# Altium schematic sheet IMX8_PMIC.SchDoc
size 594 x 420 mm; SheetNumber: 11; SheetTotal: 12
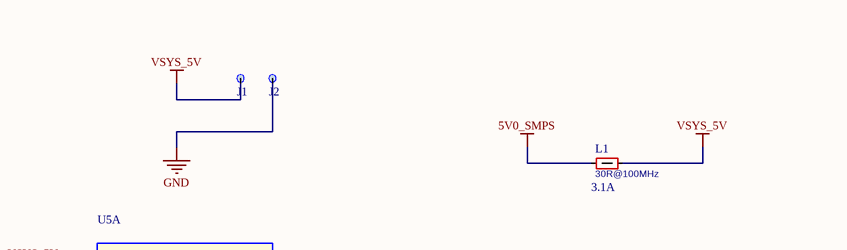
[diagram p0: IMX8_PMIC.SchDoc, top left]
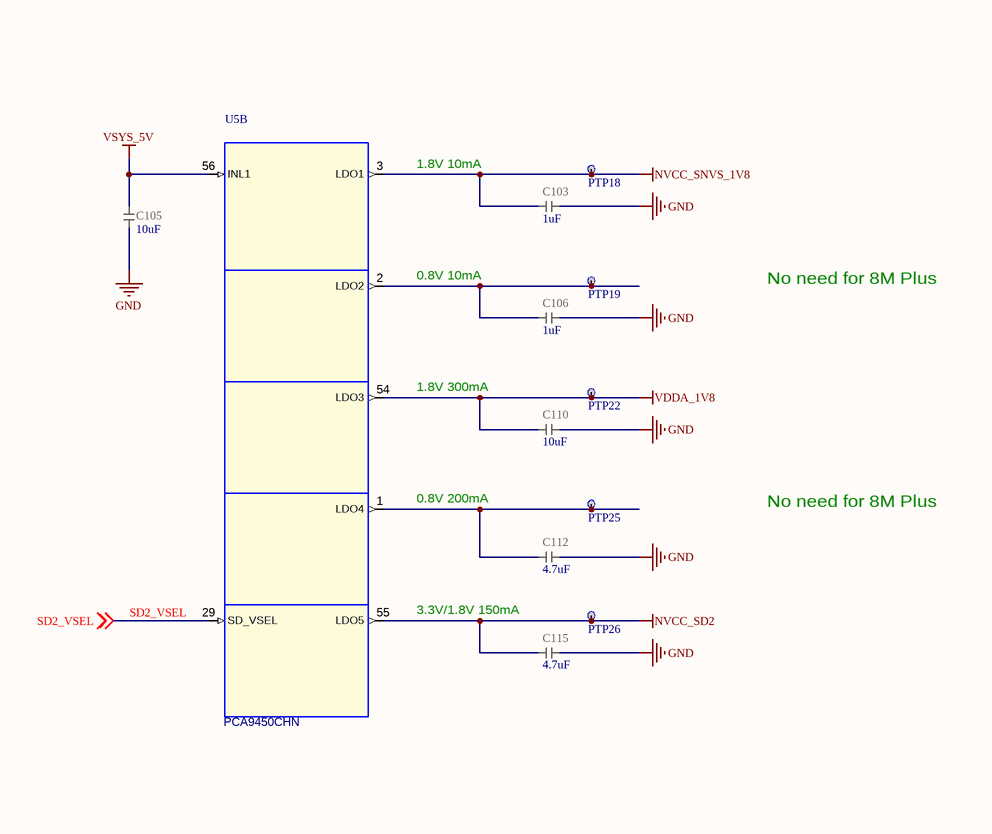
[diagram p1: IMX8_PMIC.SchDoc, top right]
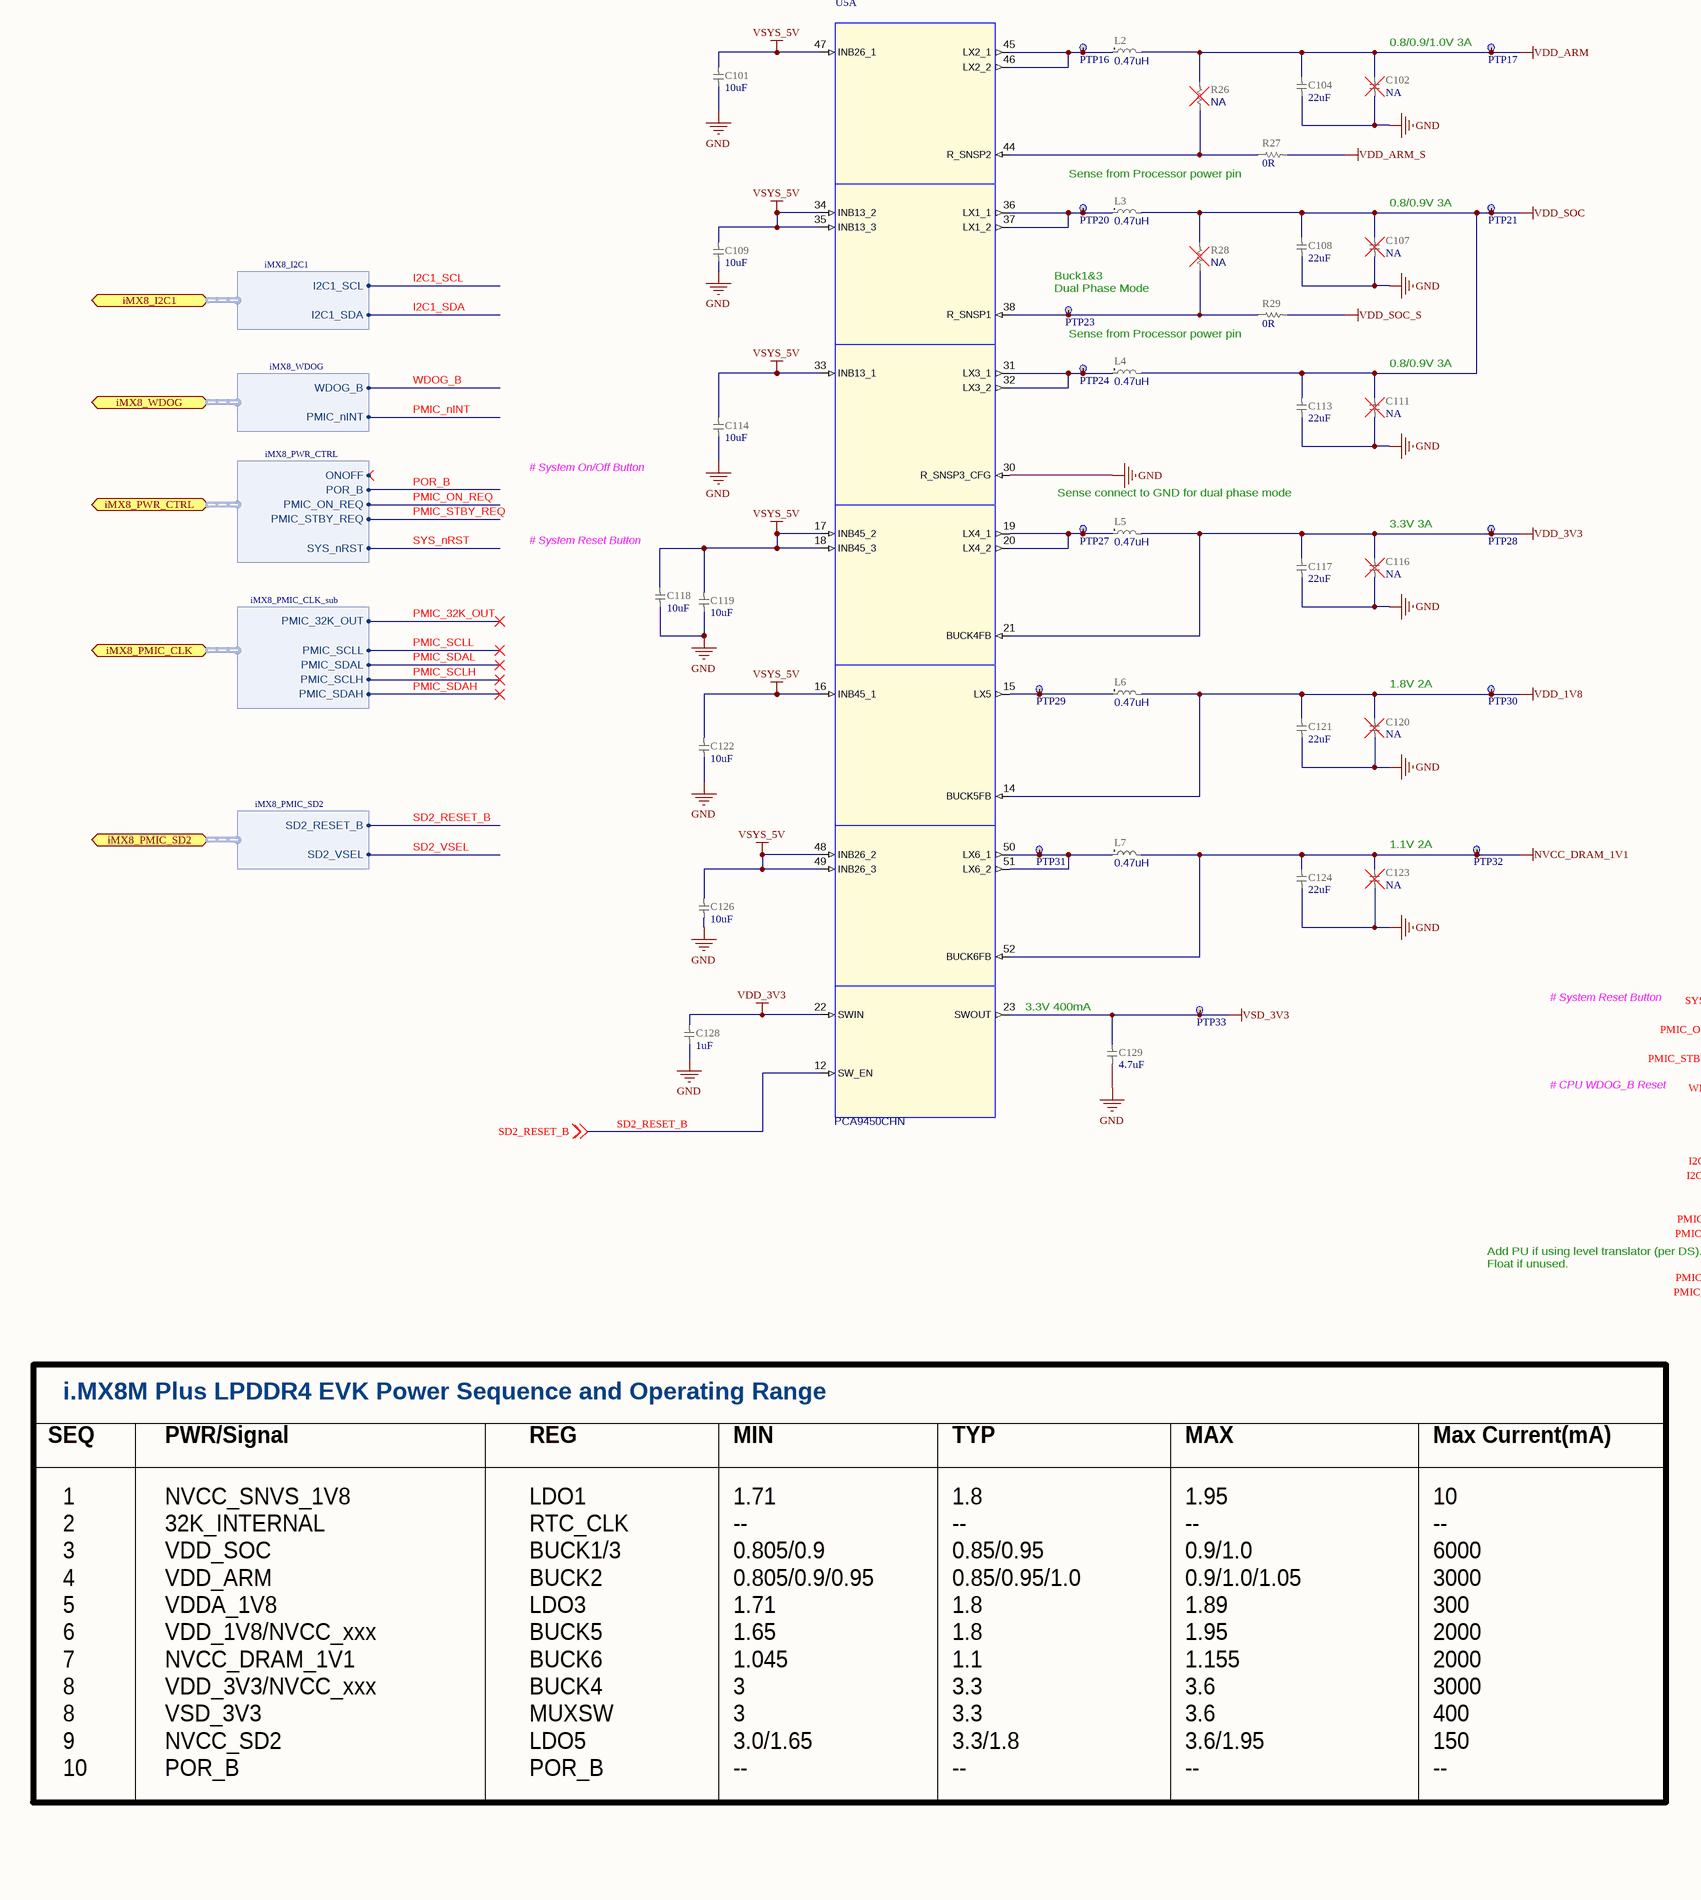
[diagram p2: IMX8_PMIC.SchDoc, bottom left]
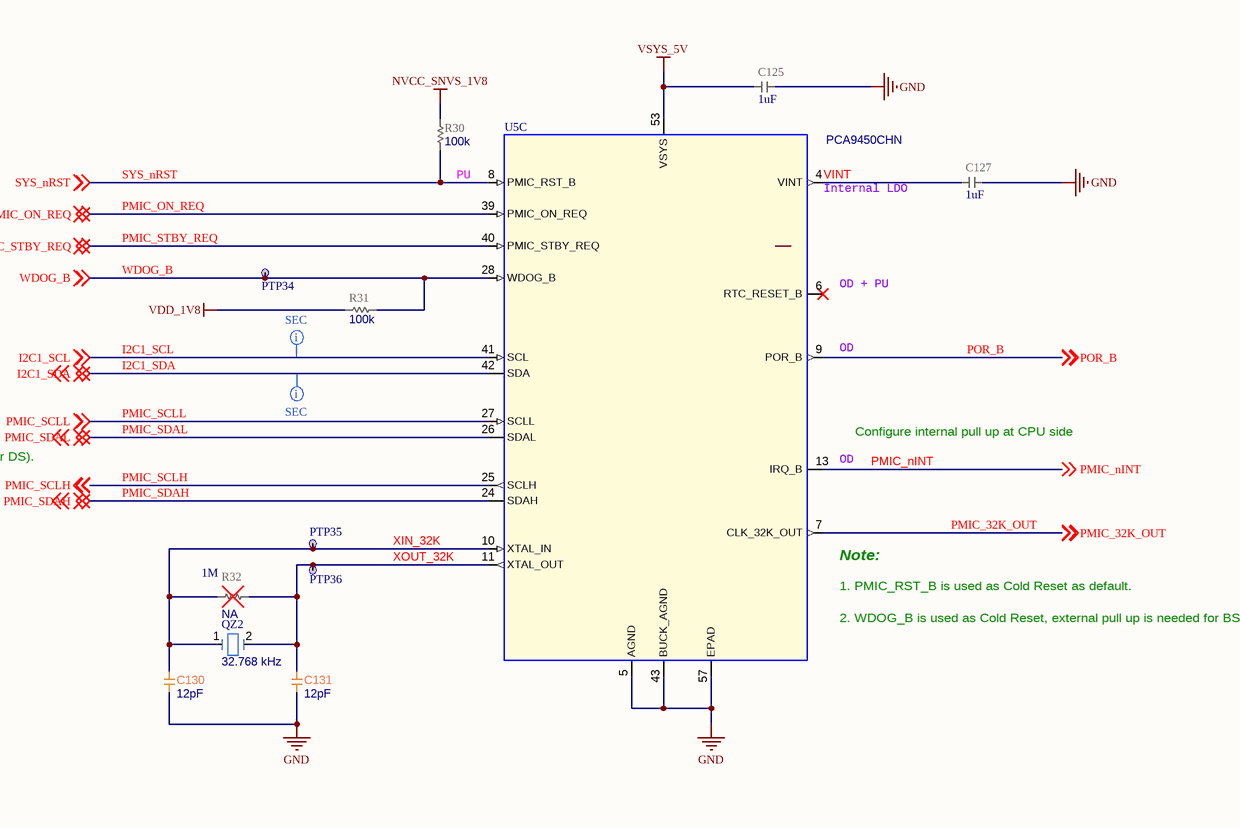
[diagram p3: IMX8_PMIC.SchDoc, bottom right]

## Parts
C101  value 10uF  [CAP_0603_UN1Q]  (hidden comment: CAP_0603_10u_10V_X7R)
C102  value NA  [CAP_0603_UN1Q]  (hidden comment: CAP_0603_NA)
C103  value 1uF  [CAP_0201_UN1Q]  (hidden comment: CAP_0201_1uF_X6S)
C104  value 22uF  [CAP_0603_UN1Q]  (hidden comment: CAP_0603_22u_6.3V_X6S)
C105  value 10uF  [CAP_0603_UN1Q]  (hidden comment: CAP_0603_10u_10V_X7R)
C106  value 1uF  [CAP_0201_UN1Q]  (hidden comment: CAP_0201_1uF_X6S)
C107  value NA  [CAP_0603_UN1Q]  (hidden comment: CAP_0603_NA)
C108  value 22uF  [CAP_0603_UN1Q]  (hidden comment: CAP_0603_22u_6.3V_X6S)
C109  value 10uF  [CAP_0603_UN1Q]  (hidden comment: CAP_0603_10u_10V_X7R)
C110  value 10uF  [CAP_0402_H09W07_UN1Q]  (hidden comment: CAP_0402_10u_X6S)
C111  value NA  [CAP_0603_UN1Q]  (hidden comment: CAP_0603_NA)
C112  value 4.7uF  [CAP_0402_H09W07_UN1Q]  (hidden comment: CAP_0402_4u7_10V_X6S)
C113  value 22uF  [CAP_0603_UN1Q]  (hidden comment: CAP_0603_22u_6.3V_X6S)
C114  value 10uF  [CAP_0603_UN1Q]  (hidden comment: CAP_0603_10u_10V_X7R)
C115  value 4.7uF  [CAP_0402_H09W07_UN1Q]  (hidden comment: CAP_0402_4u7_10V_X6S)
C116  value NA  [CAP_0603_UN1Q]  (hidden comment: CAP_0603_NA)
C117  value 22uF  [CAP_0603_UN1Q]  (hidden comment: CAP_0603_22u_6.3V_X6S)
C118  value 10uF  [CAP_0603_UN1Q]  (hidden comment: CAP_0603_10u_10V_X7R)
C119  value 10uF  [CAP_0603_UN1Q]  (hidden comment: CAP_0603_10u_10V_X7R)
C120  value NA  [CAP_0603_UN1Q]  (hidden comment: CAP_0603_NA)
C121  value 22uF  [CAP_0603_UN1Q]  (hidden comment: CAP_0603_22u_6.3V_X6S)
C122  value 10uF  [CAP_0603_UN1Q]  (hidden comment: CAP_0603_10u_10V_X7R)
C123  value NA  [CAP_0603_UN1Q]  (hidden comment: CAP_0603_NA)
C124  value 22uF  [CAP_0603_UN1Q]  (hidden comment: CAP_0603_22u_6.3V_X6S)
C125  value 1uF  [CAP_0402_UN1Q]  (hidden comment: CAP_0402_1uF_10V_X7R)
C126  value 10uF  [CAP_0603_UN1Q]  (hidden comment: CAP_0603_10u_10V_X7R)
C127  value 1uF  [CAP_0402_UN1Q]  (hidden comment: CAP_0402_1uF_10V_X7R)
C128  value 1uF  [CAP_0402_UN1Q]  (hidden comment: CAP_0402_1uF_10V_X7R)
C129  value 4.7uF  [CAP_0402_H09W07_UN1Q]  (hidden comment: CAP_0402_4u7_10V_X6S)
C130  value 12pF  [CAP_0201_UN1Q]  (hidden comment: CAP_0201_12pF_RF_MATCHING)
C131  value 12pF  [CAP_0201_UN1Q]  (hidden comment: CAP_0201_12pF_RF_MATCHING)
J1  PAD 1 x 2 mm  [TP_1x2mm_UN1Q]  (value not drawn)  (no BOM)
J2  PAD 1 x 2 mm  [TP_1x2mm_UN1Q]  (value not drawn)  (no BOM)
L1  value 30R@100MHz  Current: 3.1A  [FERR_BLM15KD]  (hidden comment: FERRITE_0402_BLM15KD)
L2  value 0.47uH  [IND_VLS2520]  (hidden comment: IND_VLS2520_0u47)
L3  value 0.47uH  [IND_VLS2520]  (hidden comment: IND_VLS2520_0u47)
L4  value 0.47uH  [IND_VLS2520]  (hidden comment: IND_VLS2520_0u47)
L5  value 0.47uH  [IND_VLS2520]  (hidden comment: IND_VLS2520_0u47)
L6  value 0.47uH  [IND_VLS2520]  (hidden comment: IND_VLS2520_0u47)
L7  value 0.47uH  [IND_VLS2520]  (hidden comment: IND_VLS2520_0u47)
PTP16  PTP_0.4mm  [PTP_0.4mm]  (value not drawn)  (no BOM)
PTP17  PTP_0.4mm  [PTP_0.4mm]  (value not drawn)  (no BOM)
PTP18  PTP_0.4mm  [PTP_0.4mm]  (value not drawn)  (no BOM)
PTP19  PTP_0.4mm  [PTP_0.4mm]  (value not drawn)  (no BOM)
PTP20  PTP_0.4mm  [PTP_0.4mm]  (value not drawn)  (no BOM)
PTP21  PTP_0.4mm  [PTP_0.4mm]  (value not drawn)  (no BOM)
PTP22  PTP_0.4mm  [PTP_0.4mm]  (value not drawn)  (no BOM)
PTP23  PTP_0.4mm  [PTP_0.4mm]  (value not drawn)  (no BOM)
PTP24  PTP_0.4mm  [PTP_0.4mm]  (value not drawn)  (no BOM)
PTP25  PTP_0.4mm  [PTP_0.4mm]  (value not drawn)  (no BOM)
PTP26  PTP_0.4mm  [PTP_0.4mm]  (value not drawn)  (no BOM)
PTP27  PTP_0.4mm  [PTP_0.4mm]  (value not drawn)  (no BOM)
PTP28  PTP_0.4mm  [PTP_0.4mm]  (value not drawn)  (no BOM)
PTP29  PTP_0.4mm  [PTP_0.4mm]  (value not drawn)  (no BOM)
PTP30  PTP_0.4mm  [PTP_0.4mm]  (value not drawn)  (no BOM)
PTP31  PTP_0.4mm  [PTP_0.4mm]  (value not drawn)  (no BOM)
PTP32  PTP_0.4mm  [PTP_0.4mm]  (value not drawn)  (no BOM)
PTP33  PTP_0.4mm  [PTP_0.4mm]  (value not drawn)  (no BOM)
PTP34  PTP_0.4mm  [PTP_0.4mm]  (value not drawn)  (no BOM)
PTP35  PTP_0.4mm  [PTP_0.4mm]  (value not drawn)  (no BOM)
PTP36  PTP_0.4mm  [PTP_0.4mm]  (value not drawn)  (no BOM)
QZ2  value 32.768 kHz  [CM8V32768TA020125_MC]  (hidden comment: XTAL_CM8V-T1A-32_768KHZ-9PF-20PPM-TA-QC)
R26  value NA  [RES_0201_UN1Q]  (hidden comment: RES_0201_NA)
R27  value 0R  [RES_0201_UN1Q]  (hidden comment: RES_0201_0R)
R28  value NA  [RES_0201_UN1Q]  (hidden comment: RES_0201_NA)
R29  value 0R  [RES_0201_UN1Q]  (hidden comment: RES_0201_0R)
R30  value 100k  [RES_0201_UN1Q]  (hidden comment: RES_0201_100k)
R31  value 100k  [RES_0201_UN1Q]  (hidden comment: RES_0201_100k)
R32  value NA  [RES_0201_UN1Q]  (hidden comment: RES_0201_NA)
U5  Part Number: PCA9450CHN  [QFN57P40_700X700X100NXP]  (hidden comment: PCA9450_HVQFN56P_A)  (parts A,B,C of 3)

## Ports
iMX8_I2C1 (bidir, harness iMX8_I2C1), iMX8_PMIC_CLK (bidir, harness iMX8_PMIC_CLK_sub), iMX8_PMIC_SD2 (bidir, harness iMX8_PMIC_SD2), iMX8_PWR_CTRL (bidir, harness iMX8_PWR_CTRL), iMX8_WDOG (bidir, harness iMX8_WDOG)

## Harnesses
iMX8_PMIC_CLK_sub: PMIC_32K_OUT, PMIC_SCLL, PMIC_SDAL, PMIC_SCLH, PMIC_SDAH
iMX8_WDOG: WDOG_B, PMIC_nINT
iMX8_I2C1: I2C1_SCL, I2C1_SDA
iMX8_PWR_CTRL: ONOFF, POR_B, PMIC_ON_REQ, PMIC_STBY_REQ, SYS_nRST
iMX8_PMIC_SD2: SD2_RESET_B, SD2_VSEL

## Nets
5V0_SMPS: L1.1
GND: C101.1 C102.2 C103.2 C104.1 C105.1 C106.2 C107.2 C108.1 C109.1 C110.2 C111.2 C112.1 C113.1 C114.1 C115.1 C116.2 C117.1 C118.1 C119.1 C120.1 C121.2 C122.1 C123.2 C124.1 C125.1 C126.1 C127.1 C128.1 C129.2 C130.2 C131.2 J2.1(TP) U5.5(AGND) U5.30(R_SNSP3_CFG) U5.43(BUCK_AGND) U5.57(EPAD)
NVCC_DRAM_1V1: C123.1 C124.2 L7.2 PTP32.1(TP) U5.52(BUCK6FB)
NVCC_SD2: C115.2 PTP26.1(TP) U5.55(LDO5)
NVCC_SNVS_1V8: C103.1 PTP18.1(TP) R30.1 U5.3(LDO1)
VDD_1V8: C120.2 C121.1 L6.2 PTP30.1(TP) R31.1 U5.14(BUCK5FB)
VDD_3V3: C116.1 C117.2 C128.2 L5.2 PTP28.1(TP) U5.21(BUCK4FB) U5.22(SWIN)
VDD_ARM: C102.1 C104.2 L2.2 PTP17.1(TP) R26.2
VDD_ARM_S: R27.2
VDD_SOC: C107.1 C108.2 C111.1 C113.2 L3.2 L4.2 PTP21.1(TP) R28.2
VDD_SOC_S: R29.2
VDDA_1V8: C110.1 PTP22.1(TP) U5.54(LDO3)
VSD_3V3: C129.1 PTP33.1(TP) U5.23(SWOUT)
VSYS_5V: C101.2 C105.2 C109.2 C114.2 C118.2 C119.2 C122.2 C125.2 C126.2 J1.1(TP) L1.2 U5.16(INB45_1) U5.17(INB45_2) U5.18(INB45_3) U5.33(INB13_1) U5.34(INB13_2) U5.35(INB13_3) U5.47(INB26_1) U5.48(INB26_2) U5.49(INB26_3) U5.53(VSYS) U5.56(INL1)
I2C1_SCL: U5.41(SCL) ; off-sheet I2C1_SCL, port iMX8_I2C1.I2C1_SCL
I2C1_SDA: U5.42(SDA) ; off-sheet I2C1_SDA, port iMX8_I2C1.I2C1_SDA
PMIC_32K_OUT: U5.7(CLK_32K_OUT) ; off-sheet PMIC_32K_OUT, port iMX8_PMIC_CLK.PMIC_32K_OUT
PMIC_nINT: U5.13(IRQ_B) ; off-sheet PMIC_nINT, port iMX8_WDOG.PMIC_nINT
PMIC_ON_REQ: U5.39(PMIC_ON_REQ) ; off-sheet PMIC_ON_REQ, port iMX8_PWR_CTRL.PMIC_ON_REQ
PMIC_SCLH: U5.25(SCLH) ; off-sheet PMIC_SCLH, port iMX8_PMIC_CLK.PMIC_SCLH
PMIC_SCLL: U5.27(SCLL) ; off-sheet PMIC_SCLL, port iMX8_PMIC_CLK.PMIC_SCLL
PMIC_SDAH: U5.24(SDAH) ; off-sheet PMIC_SDAH, port iMX8_PMIC_CLK.PMIC_SDAH
PMIC_SDAL: U5.26(SDAL) ; off-sheet PMIC_SDAL, port iMX8_PMIC_CLK.PMIC_SDAL
PMIC_STBY_REQ: U5.40(PMIC_STBY_REQ) ; off-sheet PMIC_STBY_REQ, port iMX8_PWR_CTRL.PMIC_STBY_REQ
POR_B: U5.9(POR_B) ; off-sheet POR_B, port iMX8_PWR_CTRL.POR_B
SD2_RESET_B: U5.12(SW_EN) ; off-sheet SD2_RESET_B, port iMX8_PMIC_SD2.SD2_RESET_B
SD2_VSEL: U5.29(SD_VSEL) ; off-sheet SD2_VSEL, port iMX8_PMIC_SD2.SD2_VSEL
SYS_nRST: R30.2 U5.8(PMIC_RST_B) ; off-sheet SYS_nRST, port iMX8_PWR_CTRL.SYS_nRST
VINT: C127.2 U5.4(VINT)
WDOG_B: PTP34.1(TP) R31.2 U5.28(WDOG_B) ; off-sheet WDOG_B, port iMX8_WDOG.WDOG_B
XIN_32K: C130.1 PTP35.1(TP) QZ2.1 R32.1 U5.10(XTAL_IN)
XOUT_32K: C131.1 PTP36.1(TP) QZ2.2 R32.2 U5.11(XTAL_OUT)
NetC106_1: C106.1 PTP19.1(TP) U5.2(LDO2)
NetC112_2: C112.2 PTP25.1(TP) U5.1(LDO4)
NetL2_1: L2.1 PTP16.1(TP) U5.45(LX2_1) U5.46(LX2_2)
NetL3_1: L3.1 PTP20.1(TP) U5.36(LX1_1) U5.37(LX1_2)
NetL4_1: L4.1 PTP24.1(TP) U5.31(LX3_1) U5.32(LX3_2)
NetL5_1: L5.1 PTP27.1(TP) U5.19(LX4_1) U5.20(LX4_2)
NetL6_1: L6.1 PTP29.1(TP) U5.15(LX5)
NetL7_1: L7.1 PTP31.1(TP) U5.50(LX6_1) U5.51(LX6_2)
NetPTP23_1: PTP23.1(TP) R28.1 R29.1 U5.38(R_SNSP1)
NetR26_1: R26.1 R27.1 U5.44(R_SNSP2)

Not connected (* = marked no-connect by the designer): U5 6(RTC_RESET_B)*

## Layout directives
net class SEC: I2C1_SCL, I2C1_SDA

## Notes on the sheet
- (near PTP17) 0.8/0.9/1.0V 3A
- (near U5) 1.8V 10mA
- Sense from Processor power pin
- (near U5) 0.8V 10mA
- No need for 8M Plus
- 0.8/0.9V 3A
- (near PTP23) Buck1&3
  Dual Phase Mode
- 1.8V 300mA
- (near C111) 0.8/0.9V 3A
- (near U5) 0.8V 200mA
- # System On/Off Button
- Sense connect to GND for dual phase mode
- 3.3V/1.8V 150mA
- (near C118) # System Reset Button
- (near C116) 3.3V 3A
- (near C120) 1.8V 2A
- (near C123) 1.1V 2A
- 3.3V 400mA
- # System Reset Button
- PU
- (near U5) Internal LDO
- # CPU WDOG_B Reset
- (near U5) OD + PU
- (near U5) OD
- (near U5) Configure internal pull up at CPU side
- Add PU if using level translator (per DS).
  Float if unused.
- (near R32) 1M
- (near U5) Note:
- i.MX8M Plus LPDDR4 EVK Power Sequence and Operating Range
- (near U5) 1. PMIC_RST_B is used as Cold Reset as default.
- (near U5) 2. WDOG_B is used as Cold Reset, external pull up is needed for BSDL mode.
- SEQ
- PWR/Signal
- REG
- MIN
- TYP
- MAX
- Max Current(mA)
- NVCC_SNVS_1V8
  32K_INTERNAL
  VDD_SOC
  VDD_ARM
  VDDA_1V8
  VDD_1V8/NVCC_xxx
  NVCC_DRAM_1V1
  VDD_3V3/NVCC_xxx
  VSD_3V3
  NVCC_SD2
  POR_B
- LDO1
  RTC_CLK
  BUCK1/3
  BUCK2
  LDO3
  BUCK5
  BUCK6
  BUCK4
  MUXSW
  LDO5
  POR_B
- 1.71
  --
  0.805/0.9
  0.805/0.9/0.95
  1.71
  1.65
  1.045
  3
  3
  3.0/1.65
  --
- 1.8
  --
  0.85/0.95
  0.85/0.95/1.0
  1.8
  1.8
  1.1
  3.3
  3.3
  3.3/1.8
  --
- 1.95
  --
  0.9/1.0
  0.9/1.0/1.05
  1.89
  1.95
  1.155
  3.6
  3.6
  3.6/1.95
  --
- 10
  --
  6000
  3000
  300
  2000
  2000
  3000
  400
  150
  --
- 1
  2
  3
  4
  5
  6
  7
  8
  8
  9
  10
- DWG NO:
- REV:
- THIS DOCUMENT AND THE DATA DISCLOSED HEREIN OR
- HEREWITH IS THE PROPERTY OF ALTIUM LIMITED AND MAY
- BE FREELY DISTRIBUTED IN WHOLE. NO RIGHTS ARE
- RESERVED OR EXPRESS OR IMPLIED WARANTEE GIVEN.
- REVISION
- DESCRIPTION
- DATE
- APPROVED
- ENG:
- APPROVALS
- PROJECT
- DSN:
- CHK:
- REFERENCE DOCUMENTS
- PROJECT REVISION:
- TITLE
- DOCUMENT REVISION:
- DESIGN ITEM:
- BOM:
- FAB DWG:
- PCB DWG:
- ASSY DWG:
- SCALE:
- A2
- SIZE
- CAGE CODE
- FILE NAME
- DWG NO.
- SHEET
- OF
- REV

## Library data of the parts
C101 C105 C109 C114 C118 C119 C122 C126 = CMP-001-001253-9: CAP; Part Number: GRM188Z71A106KA73D; Manufacturer: Murata; Voltage: 10V; Tolerance: +/-10%; Temperature characteristics: X7R; Sort order: 306; Alternative component: Allowed; System: RLC; Package: 0603; ComponentLink1Description: 1_Datasheet; ComponentLink2Description: 2_Product page; ComponentLink3Description: 3_X-information; ComponentLink4Description: 4_X-information; Creation date: 20240404; Manufacturer Part Number: GRM188Z71A106KA73D; Component Type: Capacitor
C102 C107 C111 C116 C120 C123 = CMP-001-000259-10: Not Assembled - CAP; Sort order: 999; System: RLC; HasBeenBuilt: TBD; Creation date: 20190101; Package: 0603; Source: RLC_UN1Q.SchLib; ComponentLink3Description: 3_X-information; ComponentLink1Description: 1_Datasheet; ComponentLink2Description: 2_Product page; ComponentLink4Description: 4_X-information; Component Type: Capacitor
C103 C106 = CMP-001-000336-15: CAP; Part Number: KGM03CS61A105MH; Manufacturer: KYOCERA AVX; Temperature characteristics: X6S; Voltage: 10V; Tolerance: +/-20%; Sort order: 302; HasBeenBuilt: False; Alternative component: Allowed; System: RLC; Package: 0201; Operating temperature range: -55C to +105C; ClassName: SMALL; ComponentLink1Description: 1_Datasheet; ComponentLink2Description: 2_Product page; ComponentLink3Description: 3_X-information; ComponentLink4Description: 4_X-information; Creation date: 20190101; Source: RLC_UN1Q.SchLib; Manufacturer Part Number: KGM03CS61A105MH; Component Type: Capacitor
C104 C108 C113 C117 C121 C124 = CMP-001-000890-13: CAP; Part Number: GRM188C80J226ME15D; Manufacturer: Murata; Voltage: 6.3V; Tolerance: +/-20%; Temperature characteristics: X6S; Sort order: 306; HasBeenBuilt: TBD; Alternative component: Allowed; System: RLC; Package: 0603; ComponentLink1Description: 1_Datasheet; ComponentLink2Description: 2_Product page; ComponentLink3Description: 3_X-information; ComponentLink4Description: 4_X-information; Creation date: 26042024; Manufacturer Part Number: GRM188C80J226ME15D; Component Type: Capacitor
C110 = CMP-001-000883-14: CAP; Part Number: GMC04X6S106M6R3NT; Manufacturer: Cal-Chip Electronics; Voltage: 6.3V; Tolerance: +/-20%; Temperature characteristics: X6S; Sort order: 304; HasBeenBuilt: TBD; Alternative component: Allowed; System: RLC; Package: 0402; ComponentLink1Description: 1_Datasheet; ComponentLink2Description: 2_Product page; ComponentLink3Description: 3_X-information; ComponentLink4Description: 4_X-information; Creation date: 26042024; Manufacturer Part Number: GMC04X6S106M6R3NT; Component Type: Capacitor
C112 C115 C129 = CMP-001-000888-12: CAP; Part Number: GRT155C81A475ME13J; Manufacturer: Murata; Sort order: 304; HasBeenBuilt: TBD; Alternative component: Allowed; System: RLC; Voltage: 10V; Temperature characteristics: X6S; Tolerance: +/-10%; ComponentLink2Description: 2_Product page; Package: 0402; Creation date: 26042024; ComponentLink1Description: 1_Datasheet; ComponentLink3Description: 3_X-information; ComponentLink4Description: 4_X-information; Manufacturer Part Number: GRT155C81A475ME13J; Component Type: Capacitor
C125 C127 C128 = CMP-001-001247-9: CAP; Part Number: GRM155Z71A105KE01J; Manufacturer: Murata; Temperature characteristics: X7R; Voltage: 10V; Tolerance: +/-10%; Sort order: 304; Alternative component: Allowed; System: RLC; Package: 0402; ComponentLink1Description: 1_Datasheet; ComponentLink2Description: 2_Product page; ComponentLink3Description: 3_X-information; ComponentLink4Description: 4_X-information; Creation date: 20240404; Manufacturer Part Number: GRM155Z71A105KE01J; Component Type: Capacitor
C130 C131 = CMP-001-000420-11: CAP_RF_MATCHING; Part Number: GRM0335C1H120GA01; Manufacturer: Murata; Voltage: 50V; Tolerance: +/- 2%; Temperature characteristics: C0G; Remark: RF matching, use part number; Sort order: 202; HasBeenBuilt: TBD; System: RLC; Package: 0201; Operating temperature range: -55 ... +125C; ComponentLink1Description: 1_Datasheet; ComponentLink2Description: 2_Product page; ComponentLink3Description: 3_X-information; ComponentLink4Description: 4_X-information; Creation date: 20211123; ClassName: SMALL; Source: RLC_UN1Q.SchLib; Manufacturer Part Number: GRM0335C1H120GA01; Component Type: Capacitor
J1 J2 = CMP-001-000157-12: Part Number: TP 1x2mm; System: Test Point; Sort order: -; HasBeenBuilt: -; ClassName: SMALL; ComponentLink1Description: 1_Datasheet; ComponentLink2Description: 2_Product page; ComponentLink3Description: 3_X-information; ComponentLink4Description: 4_X-information; Creation date: 20200101; Source: Conn_UN1Q.SchLib; Design Item ID: TP_1x2mm; Component Type: Test Point
L1 = CMP-001-000738-12: FERRITE; Part Number: BLM15KD300SN1; Manufacturer: Murata; Manufacturer Part Number: BLM15KD300SN1D; Sort order: 364; HasBeenBuilt: Saluki2; System: Discrete; Package: 0402; Operating temperature range: -55 ... +125C; Dimensions WxLxH: 0.55mm; ComponentLink1Description: 1_Datasheet; ComponentLink1URL: https://www.murata.com/en-us/products/productdetail.aspx?cate=luNoiseSupprFilteChipFerriBead&partno=BLM15KD300SN1%23; ComponentLink2Description: 2_Product page; ComponentLink3Description: 3_X-information; ComponentLink4Description: 4_X-information; Creation date: 20200304; Source: Discrete_UN1Q.SchLib; ECCN: EAR99; RoHS: RoHS3; Component Type: Ferrite
L2-L7 = CMP-001-000947-11: IND, Low DCR shielded; Manufacturer: TDK; Part Number: VLS252012HBX-R47M-1; Sort order: 348; System: RLC; Package: 2520; Dimensions WxLxH: 2.5 x 2.0 x 1.2mm; ClassName: BIG; ComponentLink1Description: 1_Datasheet; ComponentLink1URL: https://product.tdk.com/en/system/files?file=dam/doc/product/inductor/inductor/smd/catalog/inductor_commercial_power_vls252012hbx-1_en.pdf; Operating temperature range: -40 ... +105 °C; Creation date: 09022024; Source: UUDET_KOMPONENTIT.SchLib; ComponentLink2Description: 2_Product page; ComponentLink3Description: 3_X-information; ComponentLink4Description: 4_X-information; Manufacturer Part Number: VLS252012HBX-R47M-1; Component Type: Inductor
PTP16-PTP34 = CMP-001-001296-3: Production Testpoint 0.4mm. Flying probe. Use 1mm pitch.; Part Number: PTP 0.4mm; ComponentLink4Description: 4_X-information; ComponentLink1Description: 1_Datasheet; Sort order: -; ClassName: SMALL; System: Test Point; HasBeenBuilt: -; Design Item ID: PTP_0.4mm; ComponentLink3Description: 3_X-information; Creation date: 20240909; ComponentLink2Description: 2_Product page; Component Type: Test Point
PTP35 PTP36 = CMP-001-001296-3: Production Testpoint 0.4mm. Flying probe. Use 1mm pitch.; ComponentLink4Description: 4_X-information; ComponentLink1Description: 1_Datasheet; Part Number: PTP 0.4mm; Sort order: -; ClassName: SMALL; System: Test Point; HasBeenBuilt: -; Design Item ID: PTP_0.4mm; ComponentLink3Description: 3_X-information; Creation date: 20240909; ComponentLink2Description: 2_Product page
QZ2 = CMP-001-000697-8: SMT Quartz Crystal; Manufacturer: Micro Crystal; Part Number: CM8V-T1A-32.768KHZ-9PF-20PPM-TA-QC; HasBeenBuilt: SleeveIO_01; Sort order: 455; System: Discrete; ClassName: BIG; ComponentLink1Description: 1_Datasheet; ComponentLink1URL: https://www.microcrystal.com/fileadmin/Media/Products/32kHz/Datasheet/CM8V-T1A.pdf; ComponentLink2Description: 2_Product page; ComponentLink2URL: https://www.microcrystal.com/en/products/khz-quartz-crystals/cm8v-t1a/; ComponentLink3Description: 3_X-information; ComponentLink4Description: 4_X-information; Creation date: 20210913; Dimensions WxLxH: 1.2x2.0x0.6mm; Operating temperature range: -40 .... +85 °C; Package: 2-SMD; Source: Discrete_UN1Q.SchLib; Manufacturer Part Number: CM8V-T1A-32.768KHZ-9PF-20PPM-TA-QC; Component Type: Crystal & Oscillator
R26 R28 R32 = CMP-001-000434-10: Not Assembled - RES; Sort order: 999; HasBeenBuilt: TBD; System: RLC; Package: 0201; ClassName: SMALL; ComponentLink1Description: 1_Datasheet; ComponentLink2Description: 2_Product page; ComponentLink3Description: 3_X-information; ComponentLink4Description: 4_X-information; Creation date: 20190101; Source: RLC_UN1Q.SchLib; Component Type: Resistor
R27 R29 = CMP-001-000429-13: RES; Part Number: RC0201JR-070RL; Manufacturer: YAGEO; Tolerance: 5%; Power Rating: 1/20W; Sort order: 322; HasBeenBuilt: TBD; Alternative component: Allowed; System: RLC; Package: 0201; ClassName: SMALL; ComponentLink1Description: 1_Datasheet; ComponentLink2Description: 2_Product page; ComponentLink3Description: 3_X-information; ComponentLink4Description: 4_X-information; Creation date: 20190101; Source: RLC_UN1Q.SchLib; Component Type: Resistor
R30 R31 = CMP-001-000526-11: RES; Part Number: RC0201FR-07100KL; Manufacturer: YAGEO; Tolerance: 1%; Power Rating: 1/20W; Sort order: 322; HasBeenBuilt: TBD; Alternative component: Allowed; System: RLC; Package: 0201; ClassName: SMALL; ComponentLink1Description: 1_Datasheet; ComponentLink2Description: 2_Product page; ComponentLink3Description: 3_X-information; ComponentLink4Description: 4_X-information; Creation date: 20190101; Source: RLC_UN1Q.SchLib; Component Type: Resistor
U5 = CMP-031-000204-7: POWER MANAGEMENT 2.7-5.5V HVQFN56; Manufacturer: NXP SEMICONDUCTORS; Sort order: 451; System: IC; ComponentLink1Description: 1_Datasheet; ComponentLink1URL: https://www.nxp.com/products/power-management/pmics-and-sbcs/pmics/power-management-ic-pmic-for-i-mx-8m-mini-nano-plus:PCA9450; ComponentLink2Description: 2_Product page; ComponentLink3Description: 3_X-information; ComponentLink4Description: 4_X-information; Creation date: 20240207; Dimensions WxLxH: 7.0x7.0x1.0; Operating temperature range: -40 .... +105 °C; Package: QFN56; Source: UUDET_KOMPONENTIT.SchLib; ClassName: BIG; Design Item ID: PCA9450CHN; Manufacturer Part Number: PCA9450CHN; Component Type: Power Supply